# Altium schematic sheet LMH.SchDoc
size A4; SheetNumber: 3; SheetTotal: 5
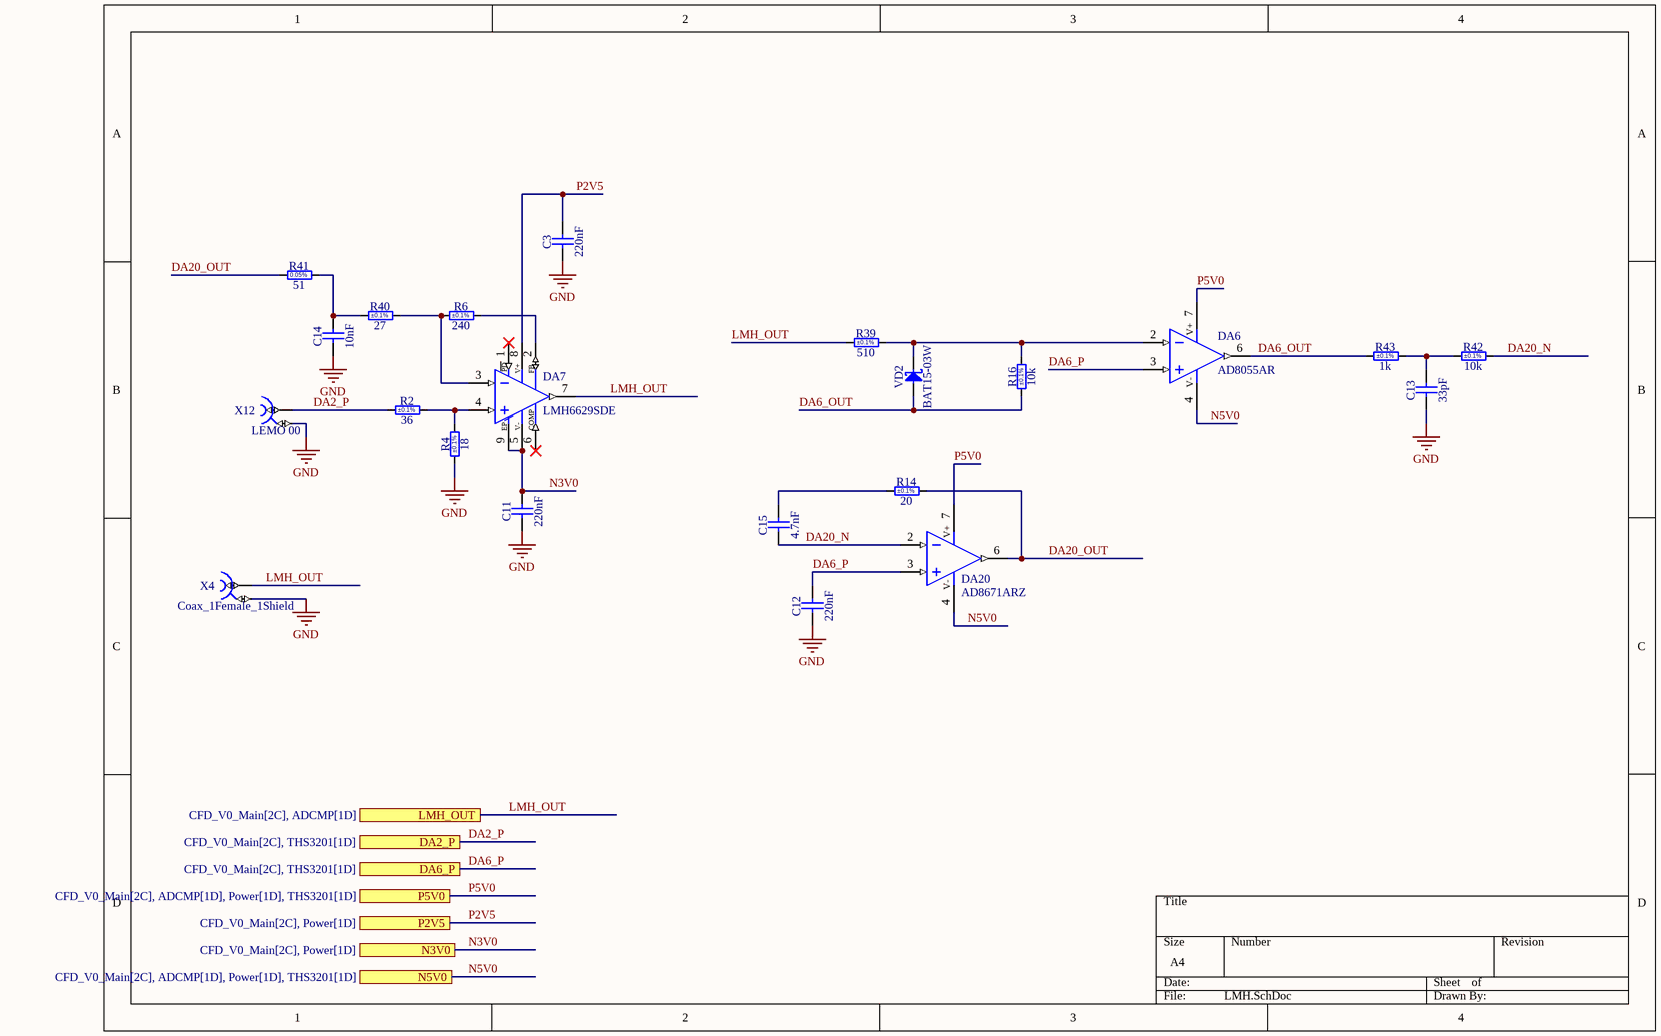
[diagram p0: LMH.SchDoc]

## Parts
C3  220nF  [CAPC2012X135N]
C11  220nF  [CAPC2012X135N]
C12  220nF  [CAPC2012X135N]
C13  33pF  [CAPC2013X115N]
C14  10nF  [CAPC2012X135N]
C15  4.7nF  [CAPC2012X135N]
DA6  AD8055AR  [SOIC127P600X175-8N]
DA7  LMH6629SDE  [TEXAS_NGQ0008A]
DA20  AD8671ARZ  [SOIC127P600X175-8N]
R2  36  Tolerance: ±0.1%  [RESC1608X64N]
R4  18  Tolerance: ±0.1%  [RESC1608X64N]
R6  240  Tolerance: ±0.1%  [RESC1005X40N]
R14  20  Tolerance: ±0.1%  [RESC2012X60N]
R16  10k  Tolerance: ±0.1%  [RESC2012X60N]
R39  510  Tolerance: ±0.1%  [RESC1005X40N]
R40  27  Tolerance: ±0.1%  [RESC1608X64N]
R41  51  [RESC2012X60N]
R42  10k  Tolerance: ±0.1%  [RESC2012X60N]
R43  1k  Tolerance: ±0.1%  [RESC2012X60N]
VD2  BAT15-03W  [SOD2512X110N]
X4  Coax_1Female_1Shield  [SAMTEC_MMCX-J-P-H-ST-TH1]
X12  LEMO 00  [LEMO_EPL.00.250.NTN]

## Ports
DA2_P (see CFD_V0_Main[2C], THS3201[1D]), DA6_P (see CFD_V0_Main[2C], THS3201[1D]), LMH_OUT (see CFD_V0_Main[2C], ADCMP[1D]), N3V0 (see CFD_V0_Main[2C], Power[1D]), N5V0 (see CFD_V0_Main[2C], ADCMP[1D], Power[1D], THS3201[1D]), P2V5 (see CFD_V0_Main[2C], Power[1D]), P5V0 (see CFD_V0_Main[2C], ADCMP[1D], Power[1D], THS3201[1D])

## Nets
GND: C3.1 C11.1 C12.1 C13.1 C14.1 R4.1 X4.2 X12.2
DA2_P: R2.1 X12.1 ; port DA2_P
DA6_OUT: DA6.6(OUT) R16.1 R43.1 VD2.2(A)
DA6_P: C12.2 DA6.3(IN+) DA20.3(IN+) ; port DA6_P
DA20_N: C15.1 DA20.2(IN-) R42.2
DA20_OUT: DA20.6(OUT) R14.2 R41.1
LMH_OUT: DA7.7(OUT) R39.1 X4.1 ; port LMH_OUT
N3V0: C11.2 DA7.5(V-) DA7.9(EP) ; port N3V0
N5V0: DA6.4(V-) DA20.4(V-) ; port N5V0
P2V5: C3.2 DA7.8(V+) ; port P2V5
P5V0: DA6.7(V+) DA20.7(V+) ; port P5V0
NetC13_2: C13.2 R42.1 R43.2
NetC14_2: C14.2 R40.1 R41.2
NetC15_2: C15.2 R14.1
NetDA6_2: DA6.2(IN-) R16.2 R39.2 VD2.1(C)
NetDA7_2: DA7.2(FB) R6.2
NetDA7_3: DA7.3(IN-) R6.1 R40.2
NetDA7_4: DA7.4(IN+) R2.2 R4.2

Not connected (* = marked no-connect by the designer): DA7 1(~{PD})* 6(COMP)*

## Notes on the sheet
- (in symbol LMH6629SDE) PD
- (in symbol R0805_51R_0.05%_0.125W_10PPM) 0.05%

## Library data of the parts
C3 C11 C12 = CC0805_220NF_50V_10%_X7R: Non-polarised capacitor; Part Description: SMD Multilayer Chip Ceramic Capacitor; Manufacturer: GENERIC; Manufacturer1 Part Number: GRM21BR71H224KA01L; Voltage: 50V; TC: X7R; Tolerance: ±10%; Part Number: CC0805_220NF_50V_10%_X7R; Component Kind: Standard; Component Type: Standard; Pin Count: 2; Value: 220nF; Status: Preferred; Manufacturer Part Number: CC0805_220NF_50V_10%_X7R; Case: 0805; Mounted: Yes; Socket: No; SMD: Yes; Sense: No; Manufacturer1 Example: MURATA; Manufacturer1 ComponentHeight: 1.35mm; HelpURL: \\cern.ch\dfs\Applications\Altium\Datasheets\CC0805_X7R_MURATA.pdf; Author: CERN DEM JLC; CreateDate: 03.12.2007; LatestRevisionDate: 03.12.2007
C13 = CC0805_33PF_200V_1%_NP0: Non-polarised capacitor; Part Description: SMD Multilayer Chip Ceramic Capacitor; Manufacturer: GENERIC; Manufacturer1 Part Number: KGQ21HCG2D330FT; Voltage: 200V; TC: C0G/NP0; Tolerance: ±1%; Part Number: CC0805_33PF_200V_1%_NP0; Component Kind: Standard; Component Type: Standard; Pin Count: 2; Value: 33pF; Status: None; Manufacturer Part Number: CC0805_33PF_200V_1%_NP0; Case: 0805; Mounted: Yes; Socket: No; SMD: Yes; Sense: No; Manufacturer1 Example: AVX; Manufacturer1 ComponentHeight: 1.15mm; HelpURL: \\cern.ch\dfs\Applications\Altium\Datasheets\CC0805_NP0_AVX_KGQ.pdf; Author: CERN DEM HF; CreateDate: 15.04.2024; LatestRevisionDate: 15.04.2024
C14 = CC0805_10NF_50V_2%_C0G: Non-polarised capacitor; Part Description: SMD Multilayer Chip Ceramic Capacitor; Manufacturer: GENERIC; Manufacturer1 Part Number: 0805N103G500CT; Voltage: 50V; TC: C0G/NP0; Tolerance: ±2%; Part Number: CC0805_10NF_50V_2%_C0G; Component Kind: Standard; Component Type: Standard; Pin Count: 2; Value: 10nF; Status: None; Manufacturer Part Number: CC0805_10NF_50V_2%_C0G; Case: 0805; Mounted: Yes; Socket: No; SMD: Yes; Sense: No; Manufacturer1 Example: Walsin Technology Corporation; Manufacturer1 ComponentHeight: 1.35mm; HelpURL: \\cern.ch\dfs\Applications\Altium\Datasheets\CC0805_C0G_Walsin.pdf; Author: CERN DEM HF; CreateDate: 15.04.2024; LatestRevisionDate: 15.04.2024
C15 = CC0805_4.7NF_250V_1%_NP0: Non-polarised capacitor; Part Description: SMD Multilayer Chip Ceramic Capacitor; Manufacturer: GENERIC; Manufacturer Part Number: CC0805_4.7NF_250V_1%_X7R; Manufacturer1 Part Number: GCM21B5C2E472FX01L; Voltage: 250V; TC: NP0; Tolerance: ±1%; Part Number: CC0805_4.7NF_250V_1%_NP0; Component Kind: Standard; Component Type: Standard; Pin Count: 2; Value: 4.7nF; Status: None; Case: 0805; Mounted: Yes; Socket: No; SMD: Yes; Sense: No; Manufacturer1 Example: MURATA; Manufacturer1 ComponentHeight: 1.45mm; HelpURL: \\cern.ch\dfs\Applications\Altium\Datasheets\CC0805_MURATA_GCM21B5C2E472FX01L.pdf; Author: CERN DEM HF; CreateDate: 15.04.2024; LatestRevisionDate: 15.04.2024
DA6 = AD8055AR: Operational Amplifier; Part Description: Low Cost, 300 MHz Voltage Feedback Amplifier; Manufacturer: ANALOG DEVICES; PressFit: No; Bonding: No; Part Number: AD8055AR; Component Kind: Standard; Component Type: Standard; Device: AD8055AR; PackageDescription: SOIC 8, Pitch 1.27mm - Body 4x5mm, IPC Medium Density; Manufacturer Part Number: AD8055AR; Pin Count: 8; Case: SOIC8; Mounted: Yes; Socket: No; SMD: Yes; Sense: No; ComponentHeight: 1.75mm; Author: CERN DEM HF; HelpURL: \\cern.ch\dfs\Applications\Altium\Datasheets\AD8055.pdf; CreateDate: 15.04.2024; LatestRevisionDate: 15.04.2024
DA7 = LMH6629SDE: Ultra-Low Noise, High-Speed Operational Amplifier with Shutdown; Manufacturer: TEXAS INSTRUMENTS; PressFit: No; Bonding: No; Part Number: LMH6629SDE; Component Kind: Standard; Component Type: Standard; Device: LMH6629SDE; PackageDescription: TEXAS Case Style NGQ(WSON-N9), SON, 0.50mm Pitch, Square; 8 Pin, 3.00mm L X 3.00mm W X 0.80mm H body (w/Thermal Tab 1.70 X 2.10mm); Part Description: Ultra-Low Noise, High-Speed Operational Amplifier with Shutdown; Manufacturer Part Number: LMH6629SDE; Pin Count: 9; Case: SON8; Mounted: Yes; Socket: No; SMD: Yes; Sense: No; ComponentHeight: 0.8mm; Author: CERN DEM HF; HelpURL: \\cern.ch\dfs\Applications\Altium\Datasheets\LMH6629.pdf; CreateDate: 12.06.2023; LatestRevisionDate: 12.06.2023
DA20 = AD8671ARZ: Operational Amplifier; Part Description: Precision, Very Low Noise, Low Input Bias Current Operational Amplifier; Manufacturer: ANALOG DEVICES; PressFit: No; Bonding: No; Part Number: AD8671ARZ; Component Kind: Standard; Component Type: Standard; Device: AD8671ARZ; PackageDescription: SOIC 8, Pitch 1.27mm - Body 4x5mm, IPC Medium Density; Manufacturer Part Number: AD8671AR; Pin Count: 8; Case: SOIC8; Mounted: Yes; Socket: No; SMD: Yes; Sense: No; ComponentHeight: 1.75mm; Author: CERN DEM JLC; HelpURL: \\cern.ch\dfs\Applications\Altium\Datasheets\AD8671ARZ.pdf; CreateDate: 17.06.2014; LatestRevisionDate: 31.03.2022
R2 = R0603_36R_0.1%_0.1W_10PPM: Resistor - 0.1%; Part Description: Thin Film Chip Resistor; Manufacturer: GENERIC; Manufacturer1 Part Number: RT0603BRC0736RL; Power: 0.1W; TC: ±10ppm/°C; PressFit: No; Part Number: R0603_36R_0.1%_0.1W_10PPM; Component Kind: Standard; Component Type: Standard; Pin Count: 2; Value: 36; Status: Not Recommended; Manufacturer Part Number: R0603_36R_0.1%_0.1W_10PPM; Case: 0603; Mounted: Yes; Sense: No; Socket: No; SMD: Yes; Manufacturer1 Example: YAGEO; Manufacturer1 ComponentHeight: 0.55mm; HelpURL: \\cern.ch\dfs\Applications\Altium\Datasheets\R0603_YAGEO_RT.pdf; Author: CERN DEM HF; CreateDate: 25.04.2024; LatestRevisionDate: 25.04.2024
R4 = R0603_18R_0.1%_0.1W_25PPM: Resistor - 0.1%; Part Description: Thin Film Chip Resistor; Manufacturer: GENERIC; Manufacturer1 Part Number: RT0603BRD0718RL; Power: 0.1W; TC: ±25ppm/°C; PressFit: No; Part Number: R0603_18R_0.1%_0.1W_25PPM; Component Kind: Standard; Component Type: Standard; Pin Count: 2; Value: 18; Status: Not Recommended; Manufacturer Part Number: R0603_18R_0.1%_0.1W_25PPM; Case: 0603; Mounted: Yes; Sense: No; Socket: No; SMD: Yes; Manufacturer1 Example: YAGEO; Manufacturer1 ComponentHeight: 0.55mm; HelpURL: \\cern.ch\dfs\Applications\Altium\Datasheets\R0603_YAGEO_RT.pdf; Author: CERN DEM HF; CreateDate: 25.04.2024; LatestRevisionDate: 25.04.2024
R6 = R0402_240R_0.1%_0.0625W_10PPM: Resistor - 0.1%; Part Description: Thick Film Chip Resistor; Manufacturer: GENERIC; Manufacturer1 Part Number: ERA2ARB241X; Power: 0.063W; TC: ±10ppm/°C; PressFit: No; Part Number: R0402_240R_0.1%_0.0625W_10PPM; Component Kind: Standard; Component Type: Standard; Pin Count: 2; Value: 240; Status: Not Recommended; Manufacturer Part Number: R0402_240R_0.1%_0.0625W_10PPM; Case: 0402; Mounted: Yes; Sense: No; Socket: No; SMD: Yes; Manufacturer1 Example: PANASONIC; Manufacturer1 ComponentHeight: 0.4mm; HelpURL: \\cern.ch\dfs\Applications\Altium\Datasheets\R0402_PANASONIC_ERA.pdf; Author: CERN DEM HF; CreateDate: 25.04.2024; LatestRevisionDate: 25.04.2024
R14 = R0805_20R_0.1%_0.1W_10PPM: Resistor - 0.1%; Part Description: Thin Film Chip Resistor; Manufacturer: GENERIC; Manufacturer1 Part Number: RN73C2A20RBTG; Power: 0.1W; TC: ±10ppm; PressFit: No; Part Number: R0805_20R_0.1%_0.1W_10PPM; Component Kind: Standard; Component Type: Standard; Pin Count: 2; Value: 20; Status: Not Recommended; Manufacturer Part Number: R0805_20R_0.1%_0.1W_10PPM; Case: 0805; Mounted: Yes; Sense: No; Socket: No; SMD: Yes; Manufacturer1 Example: TYCO HOLSWORTHY; Manufacturer1 ComponentHeight: 0.6mm; HelpURL: \\cern.ch\dfs\Applications\Altium\Datasheets\R0805_Tyco_RN73.pdf; Author: CERN DEM JLC; CreateDate: 03.12.2007; LatestRevisionDate: 13.03.2008
R16 R42 = R0805_10K_0.1%_0.1W_10PPM: Resistor - 0.1%; Part Description: Thin Film Chip Resistor; Manufacturer: GENERIC; Manufacturer1 Part Number: RN73C2A10KBTG; Power: 0.1W; TC: ±10ppm; PressFit: No; Part Number: R0805_10K_0.1%_0.1W_10PPM; Component Kind: Standard; Component Type: Standard; Pin Count: 2; Value: 10k; Status: Not Recommended; Manufacturer Part Number: R0805_10K_0.1%_0.1W_10PPM; Case: 0805; Mounted: Yes; Sense: No; Socket: No; SMD: Yes; Manufacturer1 Example: TYCO HOLSWORTHY; Manufacturer1 ComponentHeight: 0.6mm; HelpURL: \\cern.ch\dfs\Applications\Altium\Datasheets\R0805_Tyco_RN73.pdf; Author: CERN DEM JLC; CreateDate: 03.12.2007; LatestRevisionDate: 13.03.2008
R39 = R0402_510R_0.1%_0.0625W_10PPM: Resistor - 0.1%; Part Description: Thick Film Chip Resistor; Manufacturer: GENERIC; Manufacturer1 Part Number: ERA2ARB511X; Power: 0.063W; TC: ±10ppm/°C; PressFit: No; Part Number: R0402_510R_0.1%_0.0625W_10PPM; Component Kind: Standard; Component Type: Standard; Pin Count: 2; Value: 510; Status: Not Recommended; Manufacturer Part Number: R0402_510R_0.1%_0.0625W_10PPM; Case: 0402; Mounted: Yes; Sense: No; Socket: No; SMD: Yes; Manufacturer1 Example: PANASONIC; Manufacturer1 ComponentHeight: 0.4mm; HelpURL: \\cern.ch\dfs\Applications\Altium\Datasheets\R0402_PANASONIC_ERA.pdf; Author: CERN DEM HF; CreateDate: 25.04.2024; LatestRevisionDate: 25.04.2024
R40 = R0603_27R_0.1%_0.1W_10PPM: Resistor - 0.1%; Part Description: Thin Film Chip Resistor; Manufacturer: GENERIC; Manufacturer1 Part Number: RT0603BRB0727RL; Power: 0.1W; TC: ±10ppm/°C; PressFit: No; Part Number: R0603_27R_0.1%_0.1W_10PPM; Component Kind: Standard; Component Type: Standard; Pin Count: 2; Value: 27; Status: Not Recommended; Manufacturer Part Number: R0603_27R_0.1%_0.1W_10PPM; Case: 0603; Mounted: Yes; Sense: No; Socket: No; SMD: Yes; Manufacturer1 Example: YAGEO; Manufacturer1 ComponentHeight: 0.55mm; HelpURL: \\cern.ch\dfs\Applications\Altium\Datasheets\R0603_YAGEO_RT.pdf; Author: CERN DEM HF; CreateDate: 25.04.2024; LatestRevisionDate: 25.04.2024
R41 = R0805_51R_0.05%_0.125W_10PPM: Resistor - 0.05%; Part Description: Thin Film Chip Resistor; Manufacturer: GENERIC; Manufacturer1 Part Number: RG2012N-510-W-T1; Power: 0.1W; TC: ±10ppm/°C; Tolerance: ±0.1%; PressFit: No; Part Number: R0805_51R_0.05%_0.125W_10PPM; Component Kind: Standard; Component Type: Standard; Pin Count: 2; Value: 51; Status: Not Recommended; Manufacturer Part Number: R0805_51R_0.05%_0.125W_10PPM; Case: 0805; Mounted: Yes; Sense: No; Socket: No; SMD: Yes; Manufacturer1 Example: SUSUMU; Manufacturer1 ComponentHeight: 0.5mm; HelpURL: \\cern.ch\dfs\Applications\Altium\Datasheets\R0805_SUSUMU_RG.pdf; Author: CERN DEM HF; CreateDate: 25.04.2024; LatestRevisionDate: 25.04.2024
R43 = R0805_1K_0.1%_0.1W_10PPM: Resistor - 0.1%; Part Description: Thin Film Chip Resistor; Manufacturer: GENERIC; Manufacturer1 Part Number: RN73C2A1K0BTG; Power: 0.1W; TC: ±10ppm; PressFit: No; Part Number: R0805_1K_0.1%_0.1W_10PPM; Component Kind: Standard; Component Type: Standard; Pin Count: 2; Value: 1k; Status: Not Recommended; Manufacturer Part Number: R0805_1K_0.1%_0.1W_10PPM; Case: 0805; Mounted: Yes; Sense: No; Socket: No; SMD: Yes; Manufacturer1 Example: TYCO HOLSWORTHY; Manufacturer1 ComponentHeight: 0.6mm; HelpURL: \\cern.ch\dfs\Applications\Altium\Datasheets\R0805_TYCO_RN73.pdf; Author: CERN DEM JLC; CreateDate: 28.05.2013; LatestRevisionDate: 28.05.2013
VD2 = BAT15-03W: Schottky Diode; Part Description: Single Silicon RF Schottky Diode; Manufacturer: INFINEON; Device: BAT60A; Voltage: 4V; Power: 100mA; PressFit: No; Bonding: No; Part Number: BAT15-03W; Component Kind: Standard; Component Type: Standard; PackageDescription: Small Outline Diode (SOD-323), 1.70mm W X 1.25mm L X 1.10mm H body,  IPC Medium Density; Manufacturer Part Number: BAT15-03W; Pin Count: 2; Case: SOD-323; Mounted: Yes; Socket: No; SMD: Yes; Sense: No; ComponentHeight: 1.1mm; HelpURL: \\cern.ch\dfs\Applications\Altium\Datasheets\BAT15-03W.pdf; Author: CERN DEM HF; CreateDate: 15.04.2024; LatestRevisionDate: 15.04.2024
X4 = SAMTEC_MMCX-J-P-H-ST-TH1: Part Description: Straight Through-hole 50 Ohms Micro Mini RF Jack, MMCX Series; Manufacturer: SAMTEC; PressFit: No; Part Number: SAMTEC_MMCX-J-P-H-ST-TH1; Component Kind: Standard; Component Type: Standard; Pin Count: 2; Mounted: Yes; Socket: No; SMD: No; Sense: No; Status: None; Manufacturer Part Number: MMCX-J-P-H-ST-TH1; ComponentHeight: 4.35mm; HelpURL: \\cern.ch\dfs\Applications\Altium\Datasheets\SAMTEC_MMCX-J-P-H-ST-TH1.pdf; Author: CERN DEM JLC; CreateDate: 05.12.2012; LatestRevisionDate: 05.12.2012
X12 = LEMO_EPL.00.250.NTN: Part Description: Size 00, 50 Ohms Coaxial Elbow (90°) socket; PressFit: No; Part Number: LEMO_EPL.00.250.NTN; Component Kind: Standard; Component Type: Standard; Pin Count: 2; Family: LEMO 00; Mounted: Yes; Socket: No; SMD: No; Sense: No; Status: Obsolete; Manufacturer: LEMO; Manufacturer Part Number: EPL.00.250.NTN; ComponentHeight: 7mm; HelpURL: \\cern.ch\dfs\Applications\Altium\Datasheets\LEMO_EPL.00.250.NTN.pdf; Author: CERN DEM JLC; CreateDate: 03.12.2007; LatestRevisionDate: 11.02.2016